# EasyEDA Pro project ax08.eprj, schematic mem
Board Name: mem; Create Date: 2025-07-10; Page Name: mem; Project Name: ax08; Schematic Name: mem; Update Date: 2025-08-17; Company: EasyEDA.com; Page Size: A4; Version: V1.0
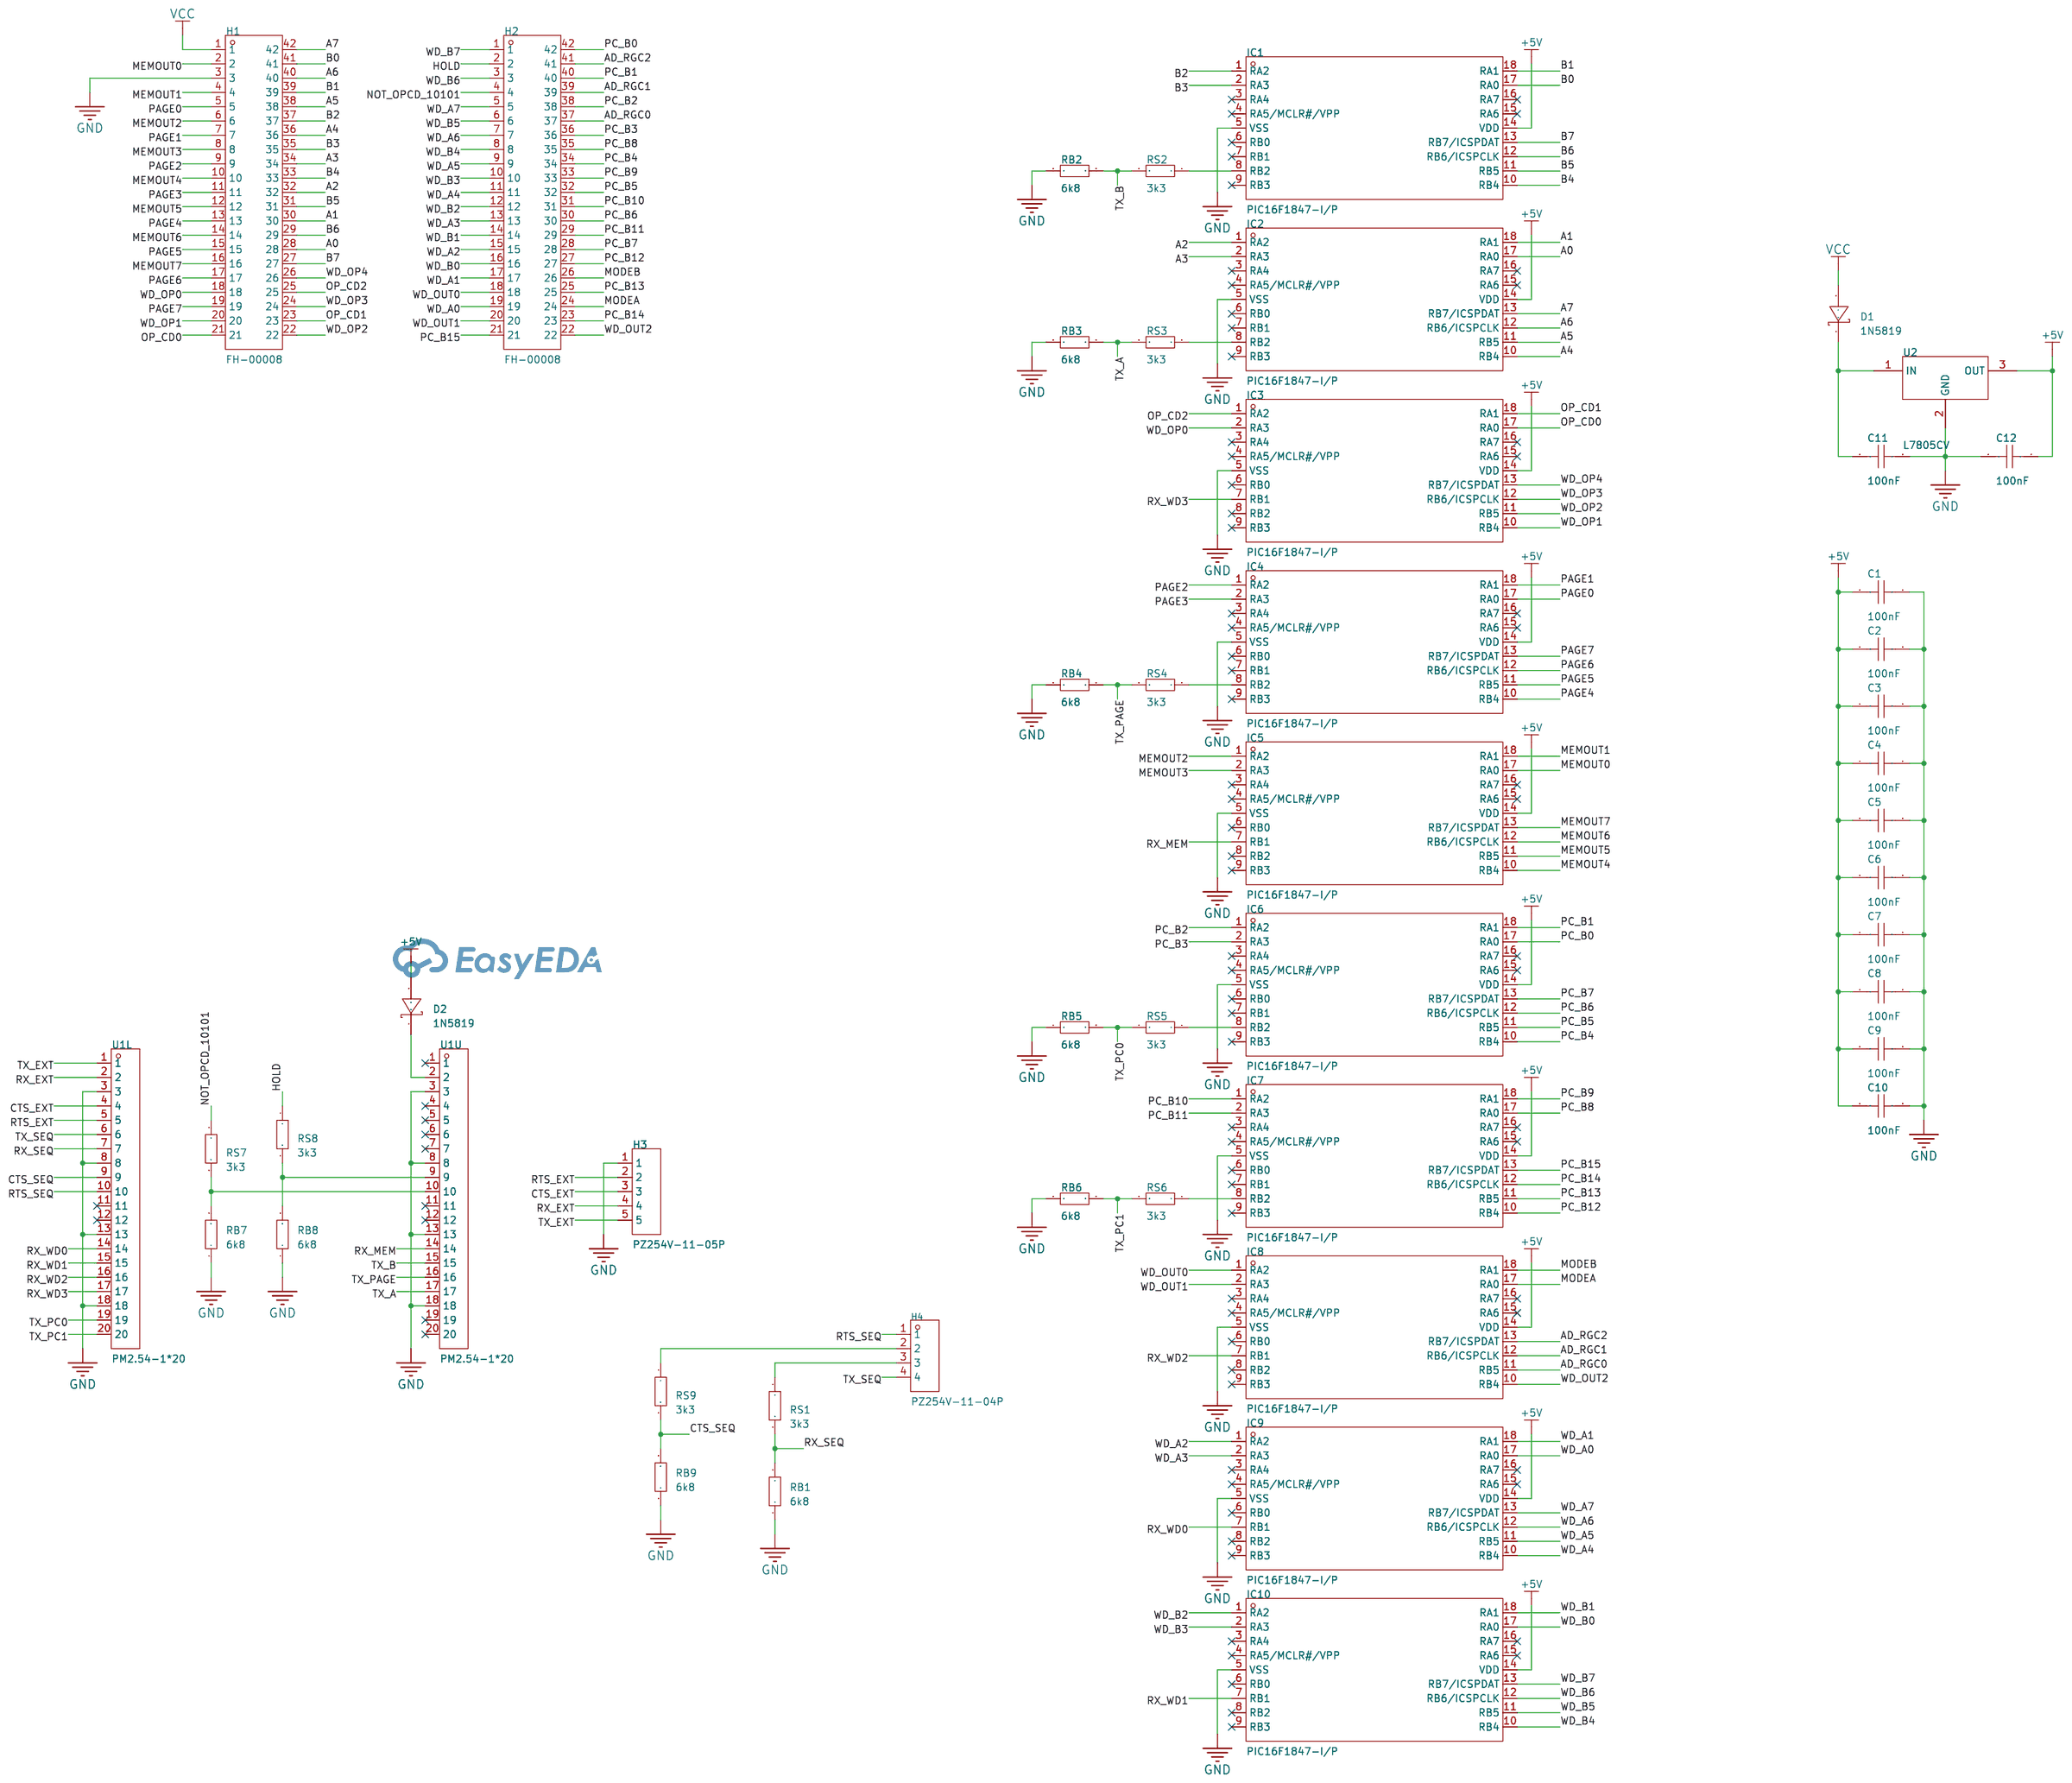
[diagram p1: schematic sheet]

## Parts
C1  100nF  [C0805]
C2  100nF  [C0805]
C3  100nF  [C0805]
C4  100nF  [C0805]
C5  100nF  [C0805]
C6  100nF  [C0805]
C7  100nF  [C0805]
C8  100nF  [C0805]
C9  100nF  [C0805]
C10  100nF  [C0805]
C11  100nF  [C0805]
C12  100nF  [C0805]
D1  1N5819  [DO-41_BD2.4-L4.7-P8.70-D0.9-RD]
D2  1N5819  [DO-41_BD2.4-L4.7-P8.70-D0.9-RD]
H1  FH-00008  [HDR-TH_42P-P2.54-V-F-R2-C21-S2.54-1]
H2  FH-00008  [HDR-TH_42P-P2.54-V-F-R2-C21-S2.54-1]
H3  PZ254V-11-05P  [HDR-TH_5P-P2.54-V-M]
H4  PZ254V-11-04P  [HDR-TH_4P-P2.54-V-M]
IC1  PIC16F1847-I/P  [PDIP-18_L22.9-W6.4-P2.54-LS7.9-BL]
IC2  PIC16F1847-I/P  [PDIP-18_L22.9-W6.4-P2.54-LS7.9-BL]
IC3  PIC16F1847-I/P  [PDIP-18_L22.9-W6.4-P2.54-LS7.9-BL]
IC4  PIC16F1847-I/P  [PDIP-18_L22.9-W6.4-P2.54-LS7.9-BL]
IC5  PIC16F1847-I/P  [PDIP-18_L22.9-W6.4-P2.54-LS7.9-BL]
IC6  PIC16F1847-I/P  [PDIP-18_L22.9-W6.4-P2.54-LS7.9-BL]
IC7  PIC16F1847-I/P  [PDIP-18_L22.9-W6.4-P2.54-LS7.9-BL]
IC8  PIC16F1847-I/P  [PDIP-18_L22.9-W6.4-P2.54-LS7.9-BL]
IC9  PIC16F1847-I/P  [PDIP-18_L22.9-W6.4-P2.54-LS7.9-BL]
IC10  PIC16F1847-I/P  [PDIP-18_L22.9-W6.4-P2.54-LS7.9-BL]
RB1  6k8  [R0805_1]
RB2  6k8  [R0805_1]
RB3  6k8  [R0805_1]
RB4  6k8  [R0805_1]
RB5  6k8  [R0805_1]
RB6  6k8  [R0805_1]
RB7  6k8  [R0805_1]
RB8  6k8  [R0805_1]
RB9  6k8  [R0805_1]
RS1  3k3  [R0805_1]
RS2  3k3  [R0805_1]
RS3  3k3  [R0805_1]
RS4  3k3  [R0805_1]
RS5  3k3  [R0805_1]
RS6  3k3  [R0805_1]
RS7  3k3  [R0805_1]
RS8  3k3  [R0805_1]
RS9  3k3  [R0805_1]
U1L  PM2.54-1*20  [HDR-TH_20P-P2.54-V-F]
U1U  PM2.54-1*20  [HDR-TH_20P-P2.54-V-F]
U2  L7805CV  [TO-220-3_L10.0-W4.5-P2.54-L]

## Library data of the parts
C1-C12 = CC0805KRX7R9BB104: Capacitance: Tolerance:±10% Tolerance:±10% Voltage Rated: Temperature Coefficient:; LCSC Part Name: 100nF ±10% 50V; Supplier Part: C49678; Manufacturer: YAGEO(国巨); Supplier Footprint: 0805; JLCPCB Part Class: Basic Part; Datasheet: https://atta.szlcsc.com/upload/public/pdf/source/20180224/C181747_15194369449651363981.pdf; Supplier: LCSC; Tolerance: ±10%
D1 D2 = 1N5819_C237257: LCSC Part Name: 电压:40V 电流:1A; Supplier Part: C237257; Manufacturer: HL(豪林); Supplier Footprint: DO-41; JLCPCB Part Class: Extended Part; Supplier: LCSC; Forward Voltage (Vf@If): 600mV@1A; Reverse Voltage (Vr): 40V; Average Rectified Current (Io): 1A
H1 H2 = FH-00008: LCSC Part Name: 间距:2.54mm 2x21P 直插; Supplier Part: C2829909; Manufacturer: Liansheng(连盛); Supplier Footprint: 插件,P=2.54mm; JLCPCB Part Class: Extended Part; Datasheet: https://atta.szlcsc.com/upload/public/pdf/source/20210507/C2829909_E013D232F5A3E6CEA712FF456C43D3BD.pdf; Supplier: LCSC; Holes Structure: 2x21P; Pitch: 2.54mm; Row Spacing: 2.54mm; Circular Hole / Square Hole: Square Hole; Mounting Type: Direct Insert; Number of Rows: Double Row; Number of Positions: 42P; Current Rating: 3A; Holes Direction: Top; Insulation Height: 8.5mm; Contact Material: Brass; Contact Plating: Gold; Operating Temperature: -40℃~+105℃
H3 = PZ254V-11-05P: LCSC Part Name: 1x5P 间距:2.54mm 方针 直插; Supplier Part: C492404; Manufacturer: XFCN(兴飞); Supplier Footprint: 插件,P=2.54mm; JLCPCB Part Class: Extended Part; Datasheet: https://atta.szlcsc.com/upload/public/pdf/source/20200309/C492404_E51533260F8710EFF5D4617281164C1D.pdf; Supplier: LCSC; Pin Structure: 1x5P; Pitch: 2.54mm; Circluar Pins/Square Pins: Policy; Mounting Type: Straight; Number of Rows: Single Row; Number of Pins: 5P; Length of Mating Pin: 6mm; Insulation Height: 2.5mm; Length of End Connection Pin: 3mm; Contact Material: Brass; Operating Temperature: -40℃~+105℃; Color: Black
H4 = PZ254V-11-04P: LCSC Part Name: 间距:2.54mm 1x4P 直插 方针; Supplier Part: C2691448; Manufacturer: XFCN(兴飞); Supplier Footprint: 插件,P=2.54mm; JLCPCB Part Class: Extended Part; Datasheet: https://atta.szlcsc.com/upload/public/pdf/source/20200309/C492403_F9F19131791D08044AD4F84F8E751A34.pdf; Supplier: LCSC; Pin Structure: 1x4P; Pitch: 2.54mm; Circluar Pins/Square Pins: Square Pins; Mounting Type: Straight; Number of Rows: Plugin; Number of Pins: 4P; Current Rating (Max): 3A; Voltage Rating (Max): 250V; Length of Mating Pin: 6mm; Insulation Height: 2.5mm; Length of End Connection Pin: 3mm; Operating Temperature Range: -40℃~+105℃; Color: Black
IC1-IC10 = PIC16F1847-I/P: CPU Core:PIC Program Storage Size:16KB RAM Size:1KB GPIO Ports Number:15 Operating Voltage Range:1.8V~5.5V Operating Voltage Range:1.8V~5.5V CPU Maximum Speed:32MHz Program Memory Type:FLASH EEPROM:8KB Operating Temperature Range:-40℃~+85℃ Operating Tempe; Supplier Part: C646910; Manufacturer: MICROCHIP(美国微芯); Supplier Footprint: PDIP-18; JLCPCB Part Class: Extended Part; Datasheet: https://atta.szlcsc.com/upload/public/pdf/source/20200624/C624148_F79067E6D18DA6D6E37021FCD51102F9.pdf; Supplier: LCSC; CPU Core: PIC; Program Storage Size: 16KB; RAM Size: 1KB; GPIO Ports Number: 15; Operating Voltage Range: 1.8V~5.5V; CPU Maximum Speed: 32MHz; Program Memory Type: FLASH; EEPROM: 8KB; Operating Temperature Range: -40℃~+85℃; ADC (Bit): 10bit; Peripheral/Function: WDT；PWM; Watchdog: 有; Low-Voltage Detect: 有; Internal Oscillator: 有
RB1-RB9 RS1-RS9 = Res_0603: Supplier Footprint: 0603
U1L U1U = PM2.54-1*20: LCSC Part Name: 间距:2.54mm 1x20P 直插; Supplier Part: C5224030; Manufacturer: ZHOURI(洲日); Supplier Footprint: 插件,P=2.54mm; JLCPCB Part Class: Extended Part; Datasheet: https://atta.szlcsc.com/upload/public/pdf/source/20221031/612FD86AB56BC97348D50ABB624A77A8.pdf; Supplier: LCSC; Holes Structure: 1x20P; Pitch: 2.54mm; Row Spacing: 2.54mm; Circular Hole / Square Hole: 方孔; Mounting Type: Straight; Number of Rows: Plugin; Number of Holes: 20P; Current Rating (Max): 2.5A; Holes Direction: Top; Insulation Height: 8.5mm; Operating Temperature Range: -40℃~+105℃
U2 = L7805CV_C111887: LCSC Part Name: 正稳压器IC; Supplier Part: C111887; Manufacturer: ST(意法半导体); Supplier Footprint: TO-220; JLCPCB Part Class: Extended Part; Datasheet: https://atta.szlcsc.com/upload/public/pdf/source/20180606/C192854_20B6D8F8F52B6FFCE5644906251095FD.pdf; Supplier: LCSC; Output Type: Fixed; Maximum Input Voltage: 35V; Output Voltage: 5V; Output Current: 1.5A; Power Supply Rejection Ratio (PSRR): 62dB@(120Hz); Dropout Voltage: 2V@(1A); standby current: 8mA; Feature: Short-Circuit  Protection；Thermal Protection(TSD)；Overcurrent Protection(OCP); Operating Temperature: 0℃~+125℃; Output Polarity: Positive electrode; Number of Outputs: 1

## Nets
+5V: C1.1 C2.1 C3.1 C4.1 C5.1 C6.1 C7.1 C8.1 C9.1 C10.1 C12.2 D2.2(A) IC1.14(VDD) IC2.14(VDD) IC3.14(VDD) IC4.14(VDD) IC5.14(VDD) IC6.14(VDD) IC7.14(VDD) IC8.14(VDD) IC9.14(VDD) IC10.14(VDD) U2.3(OUT)
GND: C1.2 C2.2 C3.2 C4.2 C5.2 C6.2 C7.2 C8.2 C9.2 C10.2 C11.2 C12.1 H1.3 H3.1 IC1.5(VSS) IC2.5(VSS) IC3.5(VSS) IC4.5(VSS) IC5.5(VSS) IC6.5(VSS) IC7.5(VSS) IC8.5(VSS) IC9.5(VSS) IC10.5(VSS) RB1.1 RB2.1 RB3.1 RB4.1 RB5.1 RB6.1 RB7.1 RB8.1 RB9.1 U1L.3 U1L.8 U1L.13 U1L.18 U1U.3 U1U.8 U1U.13 U1U.18 U2.2(GND)
VCC: D1.2(A) H1.1
A0: H1.28 IC2.17(RA0)
A1: H1.30 IC2.18(RA1)
A2: H1.32 IC2.1(RA2)
A3: H1.34 IC2.2(RA3)
A4: H1.36 IC2.10(RB4)
A5: H1.38 IC2.11(RB5)
A6: H1.40 IC2.12(RB6/ICSPCLK)
A7: H1.42 IC2.13(RB7/ICSPDAT)
AD_RGC0: H2.37 IC8.11(RB5)
AD_RGC1: H2.39 IC8.12(RB6/ICSPCLK)
AD_RGC2: H2.41 IC8.13(RB7/ICSPDAT)
B0: H1.41 IC1.17(RA0)
B1: H1.39 IC1.18(RA1)
B2: H1.37 IC1.1(RA2)
B3: H1.35 IC1.2(RA3)
B4: H1.33 IC1.10(RB4)
B5: H1.31 IC1.11(RB5)
B6: H1.29 IC1.12(RB6/ICSPCLK)
B7: H1.27 IC1.13(RB7/ICSPDAT)
CTS_EXT: H3.3 U1L.4
CTS_SEQ: RB9.2 RS9.2 U1L.9
HOLD: H2.2 RS8.1
MEMOUT0: H1.2 IC5.17(RA0)
MEMOUT1: H1.4 IC5.18(RA1)
MEMOUT2: H1.6 IC5.1(RA2)
MEMOUT3: H1.8 IC5.2(RA3)
MEMOUT4: H1.10 IC5.10(RB4)
MEMOUT5: H1.12 IC5.11(RB5)
MEMOUT6: H1.14 IC5.12(RB6/ICSPCLK)
MEMOUT7: H1.16 IC5.13(RB7/ICSPDAT)
MODEA: H2.24 IC8.17(RA0)
MODEB: H2.26 IC8.18(RA1)
NOT_OPCD_10101: H2.4 RS7.1
OP_CD0: H1.21 IC3.17(RA0)
OP_CD1: H1.23 IC3.18(RA1)
OP_CD2: H1.25 IC3.1(RA2)
PAGE0: H1.5 IC4.17(RA0)
PAGE1: H1.7 IC4.18(RA1)
PAGE2: H1.9 IC4.1(RA2)
PAGE3: H1.11 IC4.2(RA3)
PAGE4: H1.13 IC4.10(RB4)
PAGE5: H1.15 IC4.11(RB5)
PAGE6: H1.17 IC4.12(RB6/ICSPCLK)
PAGE7: H1.19 IC4.13(RB7/ICSPDAT)
PC_B0: H2.42 IC6.17(RA0)
PC_B1: H2.40 IC6.18(RA1)
PC_B2: H2.38 IC6.1(RA2)
PC_B3: H2.36 IC6.2(RA3)
PC_B4: H2.34 IC6.10(RB4)
PC_B5: H2.32 IC6.11(RB5)
PC_B6: H2.30 IC6.12(RB6/ICSPCLK)
PC_B7: H2.28 IC6.13(RB7/ICSPDAT)
PC_B8: H2.35 IC7.17(RA0)
PC_B9: H2.33 IC7.18(RA1)
PC_B10: H2.31 IC7.1(RA2)
PC_B11: H2.29 IC7.2(RA3)
PC_B12: H2.27 IC7.10(RB4)
PC_B13: H2.25 IC7.11(RB5)
PC_B14: H2.23 IC7.12(RB6/ICSPCLK)
PC_B15: H2.21 IC7.13(RB7/ICSPDAT)
RTS_EXT: H3.2 U1L.5
RTS_SEQ: H4.1 U1L.10
RX_EXT: H3.4 U1L.2
RX_MEM: IC5.7(RB1) U1U.14
RX_SEQ: RB1.2 RS1.2 U1L.7
RX_WD0: IC9.7(RB1) U1L.14
RX_WD1: IC10.7(RB1) U1L.15
RX_WD2: IC8.7(RB1) U1L.16
RX_WD3: IC3.7(RB1) U1L.17
TX_A: RB3.2 RS3.2 U1U.17
TX_B: RB2.2 RS2.2 U1U.15
TX_EXT: H3.5 U1L.1
TX_PAGE: RB4.2 RS4.2 U1U.16
TX_PC0: RB5.2 RS5.2 U1L.19
TX_PC1: RB6.2 RS6.2 U1L.20
TX_SEQ: H4.4 U1L.6
WD_A0: H2.19 IC9.17(RA0)
WD_A1: H2.17 IC9.18(RA1)
WD_A2: H2.15 IC9.1(RA2)
WD_A3: H2.13 IC9.2(RA3)
WD_A4: H2.11 IC9.10(RB4)
WD_A5: H2.9 IC9.11(RB5)
WD_A6: H2.7 IC9.12(RB6/ICSPCLK)
WD_A7: H2.5 IC9.13(RB7/ICSPDAT)
WD_B0: H2.16 IC10.17(RA0)
WD_B1: H2.14 IC10.18(RA1)
WD_B2: H2.12 IC10.1(RA2)
WD_B3: H2.10 IC10.2(RA3)
WD_B4: H2.8 IC10.10(RB4)
WD_B5: H2.6 IC10.11(RB5)
WD_B6: H2.3 IC10.12(RB6/ICSPCLK)
WD_B7: H2.1 IC10.13(RB7/ICSPDAT)
WD_OP0: H1.18 IC3.2(RA3)
WD_OP1: H1.20 IC3.10(RB4)
WD_OP2: H1.22 IC3.11(RB5)
WD_OP3: H1.24 IC3.12(RB6/ICSPCLK)
WD_OP4: H1.26 IC3.13(RB7/ICSPDAT)
WD_OUT0: H2.18 IC8.1(RA2)
WD_OUT1: H2.20 IC8.2(RA3)
WD_OUT2: H2.22 IC8.10(RB4)
$1N5488: C11.1 D1.1(K) U2.1(IN)
$1N7638: D2.1(K) U1U.2
$1N9234: IC1.8(RB2) RS2.1
$1N9380: H4.3 RS1.1
$1N9577: IC2.8(RB2) RS3.1
$1N9646: IC4.8(RB2) RS4.1
$1N9715: IC6.8(RB2) RS5.1
$1N9784: IC7.8(RB2) RS6.1
$1N10036: RB7.2 RS7.2 U1U.10
$1N10052: RB8.2 RS8.2 U1U.9
$1N11627: H4.2 RS9.1

Not connected (* = marked no-connect by the designer): IC1 3(RA4)* 4(RA5/MCLR#/VPP)* 6(RB0)* 7(RB1)* 9(RB3)* 15(RA6)* 16(RA7)*; IC2 3(RA4)* 4(RA5/MCLR#/VPP)* 6(RB0)* 7(RB1)* 9(RB3)* 15(RA6)* 16(RA7)*; IC3 3(RA4)* 4(RA5/MCLR#/VPP)* 6(RB0)* 8(RB2)* 9(RB3)* 15(RA6)* 16(RA7)*; IC4 3(RA4)* 4(RA5/MCLR#/VPP)* 6(RB0)* 7(RB1)* 9(RB3)* 15(RA6)* 16(RA7)*; IC5 3(RA4)* 4(RA5/MCLR#/VPP)* 6(RB0)* 8(RB2)* 9(RB3)* 15(RA6)* 16(RA7)*; IC6 3(RA4)* 4(RA5/MCLR#/VPP)* 6(RB0)* 7(RB1)* 9(RB3)* 15(RA6)* 16(RA7)*; IC7 3(RA4)* 4(RA5/MCLR#/VPP)* 6(RB0)* 7(RB1)* 9(RB3)* 15(RA6)* 16(RA7)*; IC8 3(RA4)* 4(RA5/MCLR#/VPP)* 6(RB0)* 8(RB2)* 9(RB3)* 15(RA6)* 16(RA7)*; IC9 3(RA4)* 4(RA5/MCLR#/VPP)* 6(RB0)* 8(RB2)* 9(RB3)* 15(RA6)* 16(RA7)*; IC10 3(RA4)* 4(RA5/MCLR#/VPP)* 6(RB0)* 8(RB2)* 9(RB3)* 15(RA6)* 16(RA7)*; U1L 11* 12*; U1U 1* 4* 5* 6* 7* 11* 12* 19* 20*
